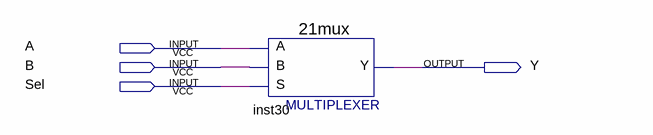
[diagram p0: schematic sheet]
// Quartus schematic TesteMUX2.bdf as structural Verilog: 1 symbols, 4 pins
module TesteMUX2 (
  input  A,
  input  B,
  input  Sel,
  output Y
);

  \21mux  inst30 (.S(Sel), .B(B), .A(A), .Y(Y));
endmodule
